# Altium schematic sheet usb.SchDoc: USB
size A4; Organization: Institut d'Automatisation Industrielle; SVN: OUI; ProjectName: <projet>
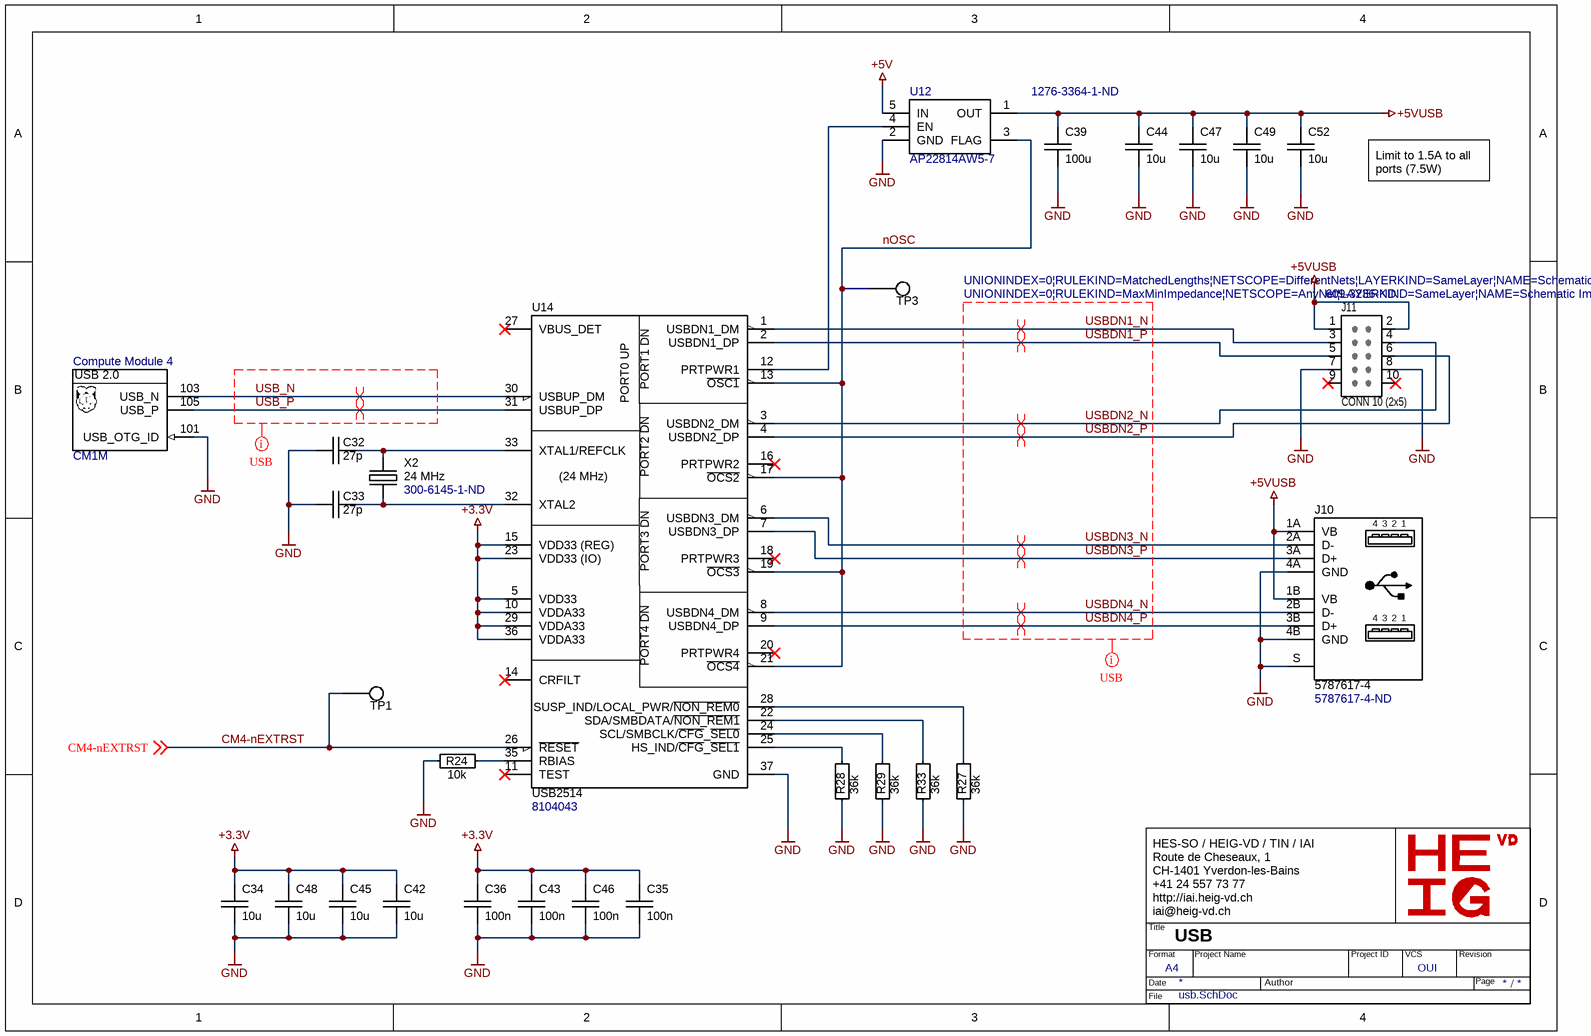
[diagram p0: usb.SchDoc]

## Parts
C32  27p  [SM/C0603]
C33  27p  [SM/C0603]
C34  10u  [SM/C0805]
C35  100n  [SM/C0603]
C36  100n  [SM/C0603]
C39  100u  Supplier Part Number 1: 1276-3364-1-ND  [SM/C1210]
C42  10u  [SM/C0805]
C43  100n  [SM/C0603]
C44  10u  [SM/C0805]
C45  10u  [SM/C0805]
C46  100n  [SM/C0603]
C47  10u  [SM/C0805]
C48  10u  [SM/C0805]
C49  10u  [SM/C0805]
C52  10u  [SM/C0805]
CM1  Compute Module 4  [CM4-RASPBERRY-PI4]  (part M of 16)
J10  5787617-4  Supplier Part Number 1: 5787617-4-ND  [TE/5787617-4]
J11  CONN 10 (2x5)  Supplier Part Number 1: 609-3236-ND  [HE/2.54/10]
R24  10k  [SM/R0805]
R27  36k  [SM/R0603]
R28  36k  [SM/R0603]
R29  36k  [SM/R0603]
R33  36k  [SM/R0603]
TP1  USB-nEXTRST  [TP/SMALL]  (value not drawn)  (no BOM)
TP3  USB-nEXTRST  [TP/SMALL]  (value not drawn)  (no BOM)
U12  AP22814AW5-7  [SOT23-5]
U14  USB2514  Supplier Part Number 1: 8104043  [QFN36_6X6_MCH]
X2  24 MHz  Supplier Part Number 1: 300-6145-1-ND  [XTAL-ECS-160-20-3X-TR]

## Nets
+3.3V: C34.1 C35.1 C36.1 C42.1 C43.1 C45.1 C46.1 C48.1 U14.5(VDD33) U14.10(VDDA33) U14.15(VDD33_(REG)) U14.23(VDD33_(IO)) U14.29(VDDA33) U14.36(VDDA33)
+5V: U12.5(IN)
+5VUSB: C39.1 C44.1 C47.1 C49.1 C52.1 J10.1A(VB) J10.1B(VB) J11.1 J11.2 U12.1(OUT)
GND: C32.2 C33.2 C34.2 C35.2 C36.2 C39.2 C42.2 C43.2 C44.2 C45.2 C46.2 C47.2 C48.2 C49.2 C52.2 CM1.101(USB_OTG_ID) J10.4A(GND) J10.4B(GND) J10.S(GND) J11.7 J11.8 R24.1 R27.1 R28.1 R29.1 R33.1 U12.2(GND) U14.37(GND)
CM4-nEXTRST: TP1.1 U14.26(~{RESET}) ; off-sheet CM4-nEXTRST
nOSC: TP3.1 U12.3(FLAG) U14.13(~{OSC1}) U14.17(~{OCS2}) U14.19(~{OCS3}) U14.21(~{OCS4})
USB_N: CM1.103(USB_N) U14.30(USBUP_DM)
USB_P: CM1.105(USB_P) U14.31(USBUP_DP)
USBDN1_N: J11.3 U14.1(USBDN1_DM)
USBDN1_P: J11.5 U14.2(USBDN1_DP)
USBDN2_N: J11.4 U14.3(USBDN2_DM)
USBDN2_P: J11.6 U14.4(USBDN2_DP)
USBDN3_N: J10.2A(D-) U14.6(USBDN3_DM)
USBDN3_P: J10.3A(D+) U14.7(USBDN3_DP)
USBDN4_N: J10.2B(D-) U14.8(USBDN4_DM)
USBDN4_P: J10.3B(D+) U14.9(USBDN4_DP)
NetC32_1: C32.1 U14.33(XTAL1/REFCLK) X2.2
NetC33_1: C33.1 U14.32(XTAL2) X2.1
NetR24_2: R24.2 U14.35(RBIAS)
NetR27_2: R27.2 U14.28(SUSP_IND/LOCAL_PWR/~{NON_REM0})
NetR28_2: R28.2 U14.25(HS_IND/~{CFG}_~{SEL1})
NetR29_2: R29.2 U14.24(SCL/SMBCLK/~{CFG}_~{SEL0})
NetR33_2: R33.2 U14.22(SDA/SMBDATA/~{NON_REM1})
NetU12_4: U12.4(EN) U14.12(PRTPWR1)

Not connected (* = marked no-connect by the designer): J11 9* 10*; U14 11(TEST)* 14(CRFILT)* 16(PRTPWR2)* 18(PRTPWR3)* 20(PRTPWR4)* 27(VBUS_DET)*

## Layout directives
differential pair: USB_N, USB_P
differential pair; differential pair class USB: USBDN1_N, USBDN1_P, USBDN2_N, USBDN2_P, USBDN3_N, USBDN3_P, USBDN4_N, USBDN4_P
rule Impedance Constraint [Min = 85.00    Max = 95.00    ]; rule Differential Pairs Routing [Pref Gap = 6.43mil    Min Gap  = 5.906mil    Max Gap  = 6.43milPref Width = 9.048mil    Min Width  = 5.906mil    Max Width  = 9.048mil]; rule Matched Net Lengths [Tolerance = 3mil]: USBDN1_N, USBDN1_P, USBDN2_N, USBDN2_P, USBDN3_N, USBDN3_P, USBDN4_N, USBDN4_P
rule Impedance Constraint [Min = 85.00    Max = 95.00    ]; rule Differential Pairs Routing [Pref Gap = 6.43mil    Min Gap  = 5.906mil    Max Gap  = 6.43milPref Width = 9.048mil    Min Width  = 5.906mil    Max Width  = 9.048mil]: USB_N, USB_P

## Notes on the sheet
- Limit to 1.5A to all ports (7.5W)
- HES-SO / HEIG-VD / TIN / IAI
  Route de Cheseaux, 1
  CH-1401 Yverdon-les-Bains
  +41 24 557 73 77
  http://iai.heig-vd.ch
  iai@heig-vd.ch
- Title
- Format
- Date
- A4
- Project Name
- Author
- Project ID
- VCS
- Revision
- Page
- /
- File
- (in symbol CM4, part M) USB 2.0
- (in symbol CONN/USB/2xA) 4; 3; 2; 1
- (in symbol USB2514B) PORT1 DN; PORT0 UP; PORT2 DN; (24 MHz); PORT3 DN; PORT4 DN

## Library data of the parts
C32 C33 C39 = C: Chip Capacitor
  C39: Supplier 1: Digi-Key
C34 C42 C44 C45 C47-C49 C52 = C: CAP CER 10UF 10V X5R 0805; Supplier 1: Digi-Key; Supplier Part Number 1: 1276-2402-1-ND
C35 C36 C43 C46 = C: Chip Capacitor; Voltage: 16V; Dielectric: X7R; Supplier 2 Part Number: 1292-1393-1-ND; Supplier 2: Digi-Key
CM1 = CM4: Raspberry Pi Compute Module 4 by Amornthep Phunsin
J10 = CONN/USB/2xA: CONN RCPT USB 8POS STACK T/H; Supplier 1: Digi-Key
R24 R27-R29 R33 = R: Chip Resistor SMD
TP1 TP3 = TP: Test Point
U12 = AP22804: Supplier 1: Digi-Key; Supplier Part Number 1: AP22814AW5-7DICT-ND
U14 = USB2514B: USB2 HUB 4-PORT; Supplier 1: RSComponents
X2 = XTAL: HCM4924000000ABJT; Supplier 1: Digi-Key
J11 = CONN 10 (2x5): Supplier 1: Digi-Key